# Altium schematic sheet McuESP32.SchDoc
size A4; SheetNumber: 2; SheetTotal: 6
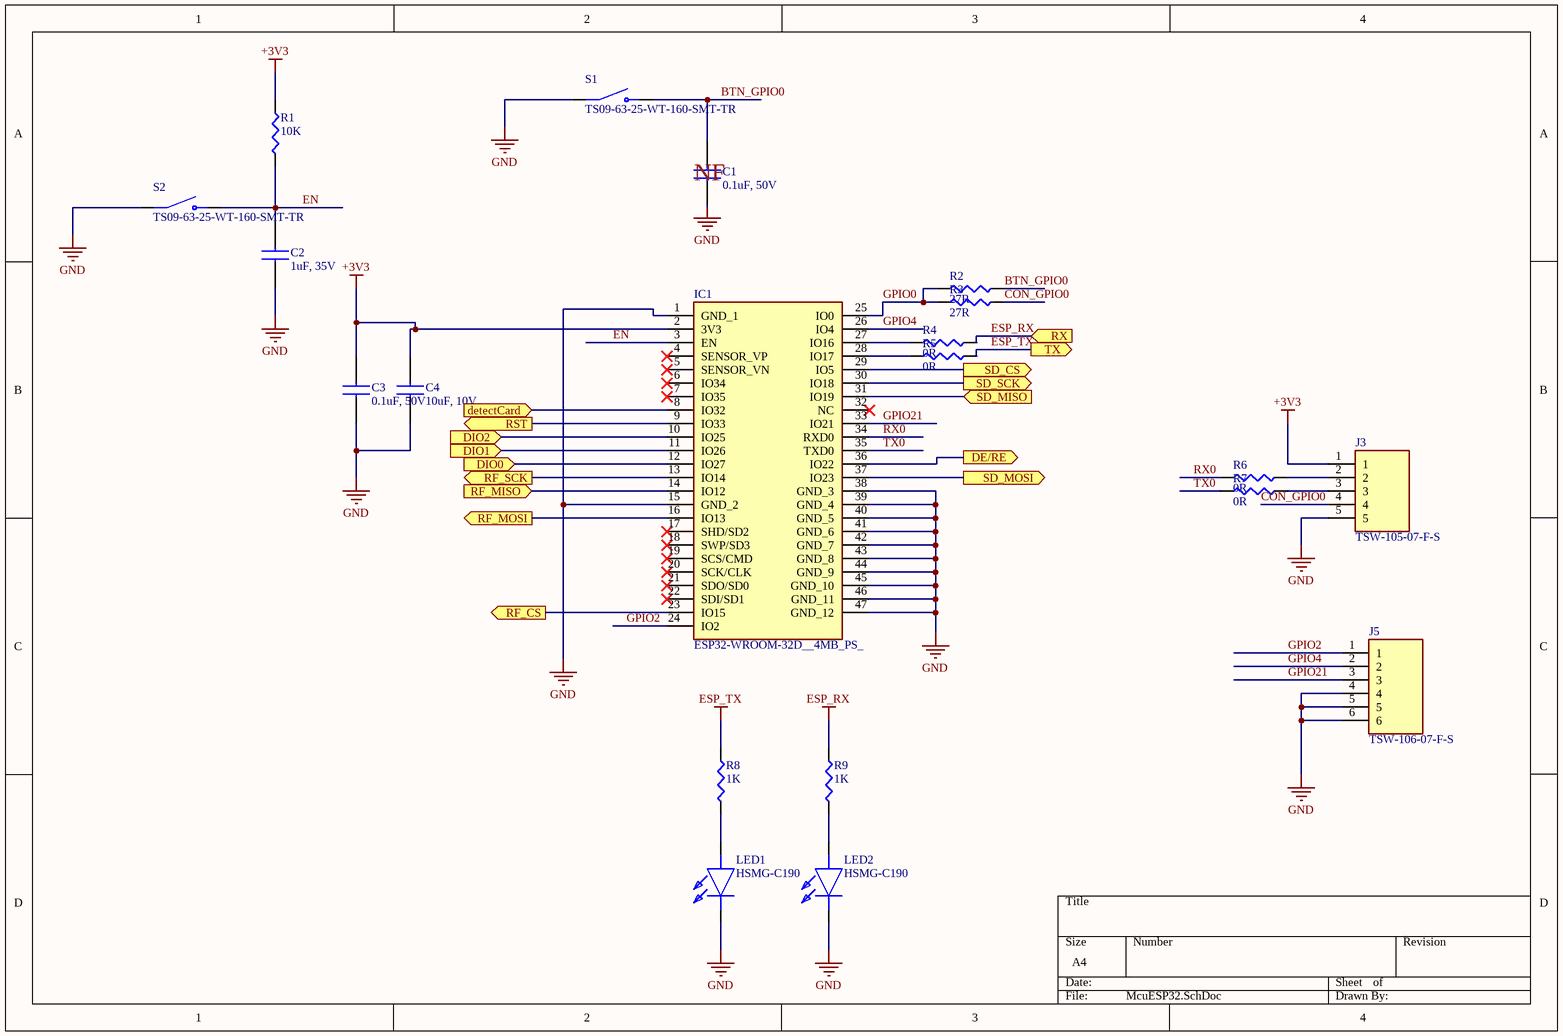
[diagram p0: McuESP32.SchDoc]

## Parts
C1  0.1uF, 50V  [CAPC1608X90N]
C2  1uF, 35V  [CAPC1608X90N]
C3  0.1uF, 50V  [CAPC1608X90N]
C4  10uF, 10V  [CAPC1608X90N]
IC1  ESP32-WROOM-32D__4MB_PS_  [ESP32WROOM32D4MBPS]
J3  TSW-105-07-F-S  [TSW-105-XX-YY-S]
J5  TSW-106-07-F-S  [TSW10607FS]
LED1  HSMG-C190  [LEDC1608X90N]
LED2  HSMG-C190  [LEDC1608X90N]
R1  10K  [RESC1607X60N]
R2  27R  [RESC1607X60N]
R3  27R  [RESC1607X60N]
R4  0R  [RESC1607X60N]
R5  0R  [RESC1607X60N]
R6  0R  [RESC1607X60N]
R7  0R  [RESC1607X60N]
R8  1K  [RESC1607X60N]
R9  1K  [RESC1607X60N]
S1  TS09-63-25-WT-160-SMT-TR  [SW_TS09-63-25-WT-160-SMT-TR]
S2  TS09-63-25-WT-160-SMT-TR  [SW_TS09-63-25-WT-160-SMT-TR]

## Ports
DE/RE (out), detectCard (in), DIO0 (in), DIO1 (in), DIO2 (in), RF_CS (out), RF_MISO (in), RF_MOSI (out), RF_SCK (out), RST (out), RX (in), SD_CS (out), SD_MISO (in), SD_MOSI (out), SD_SCK (out), TX (out)

## Nets
+3V3: C3.2 C4.1 IC1.2(3V3) J3.1 R1.2
ESP_RX: R4.2 R9.2 ; port RX
ESP_TX: R5.2 R8.2 ; port TX
GND: C1.1 C2.1 C3.1 C4.2 IC1.1(GND_1) IC1.15(GND_2) IC1.38(GND_3) IC1.39(GND_4) IC1.40(GND_5) IC1.41(GND_6) IC1.42(GND_7) IC1.43(GND_8) IC1.44(GND_9) IC1.45(GND_10) IC1.46(GND_11) IC1.47(GND_12) J3.5 J5.4 J5.5 J5.6 LED1.1(K) LED2.1(K) S1.1 S2.1
BTN_GPIO0: C1.2 R2.2 S1.2
CON_GPIO0: J3.4 R3.2
DE/RE: IC1.36(IO22) ; port DE/RE
detectCard: IC1.8(IO32) ; port detectCard
DIO0: IC1.12(IO27) ; port DIO0
DIO1: IC1.11(IO26) ; port DIO1
DIO2: IC1.10(IO25) ; port DIO2
EN: C2.2 IC1.3(EN) R1.1 S2.2
GPIO0: IC1.25(IO0) R2.1 R3.1
GPIO2: IC1.24(IO2) J5.1
GPIO4: IC1.26(IO4) J5.2
GPIO21: IC1.33(IO21) J5.3
RF_CS: IC1.23(IO15) ; port RF_CS
RF_MISO: IC1.14(IO12) ; port RF_MISO
RF_MOSI: IC1.16(IO13) ; port RF_MOSI
RF_SCK: IC1.13(IO14) ; port RF_SCK
RST: IC1.9(IO33) ; port RST
RX0: IC1.34(RXD0) R6.1
SD_CS: IC1.29(IO5) ; port SD_CS
SD_MISO: IC1.31(IO19) ; port SD_MISO
SD_MOSI: IC1.37(IO23) ; port SD_MOSI
SD_SCK: IC1.30(IO18) ; port SD_SCK
TX0: IC1.35(TXD0) R7.1
NetIC1_27: IC1.27(IO16) R4.1
NetIC1_28: IC1.28(IO17) R5.1
NetJ3_2: J3.2 R6.2
NetJ3_3: J3.3 R7.2
NetLED1_2: LED1.2(A) R8.1
NetLED2_2: LED2.2(A) R9.1

Not connected (* = marked no-connect by the designer): IC1 4(SENSOR_VP)* 5(SENSOR_VN)* 6(IO34)* 7(IO35)* 17(SHD/SD2)* 18(SWP/SD3)* 19(SCS/CMD)* 20(SCK/CLK)* 21(SDO/SD0)* 22(SDI/SD1)* 32(NC)*

## Notes on the sheet
- (near C1) NF

## Library data of the parts
C1 C3 = CL10B104KB8NNNL: CAP CER 0.1UF 50V X7R 0603; Manufacturer_Name: SAMSUNG; Datasheet Link: https://componentsearchengine.com/Datasheets/2/CL10A106MP8NNNC.pdf; Height: 0.9mm; Manufacturer_Part_Number: CL10B104KB8NNNL; Mouser Part Number: 187-CL10A106MP8NNNC; Mouser Price/Stock: https://www.mouser.co.uk/ProductDetail/Samsung-Electro-Mechanics/CL10A106MP8NNNC?qs=X6jEic%2FHinAgjcVTZfg7UA%3D%3D; Arrow Part Number: CL10A106MP8NNNC; Arrow Price/Stock: https://www.arrow.com/en/products/cl10a106mp8nnnc/samsung-electro-mechanics?utm_currency=USD&region=europe
C2 = CL10A105KL8NNNC: Ceramic Capacitor, Multilayer, Ceramic, 35V, 10% +Tol, 10% -Tol, X5R, +-15% TC, 1uF, Surface Mount, 0603 inch; Manufacturer: Samsung; Material: 4241ConductorMaterial; Supplier 1: Digikey; Manufacturer Part Number: CL10A105KL8NNNC; RoHS: Yes; Category: Ceramic Capacitors; Stock 1: 11037; Pricing 1: 1=0,13, 10=0,073, 100=0,044, 1000=0,03277 (USD); Voltage Rating (DC): 35V; Height: 900um; Lead Free: 5697LeadFree; ComponentLink1URL: https://datasheet.ciiva.com/25773/cl10a105kl8nnnc-25773809.pdf?src-supplier=Digikey; ComponentLink1Description: https://datasheet.ciiva.com/25773/cl10a105kl8nnnc-25773809.pdf?src-supplier=Digikey; ComponentLink2URL: https://datasheet.ciiva.com/16202/clseries-16202344.pdf?src-supplier=Future+Electronics; ComponentLink2Description: https://datasheet.ciiva.com/16202/clseries-16202344.pdf?src-supplier=Future+Electronics
C4 = CL10A106MP8NNNC: CAP CER 10UF 10V X5R 0603; Manufacturer_Name: SAMSUNG; Datasheet Link: https://componentsearchengine.com/Datasheets/2/CL10A106MP8NNNC.pdf; Height: 0.9mm; Manufacturer_Part_Number: CL10A106MP8NNNC; Mouser Part Number: 187-CL10A106MP8NNNC; Mouser Price/Stock: https://www.mouser.co.uk/ProductDetail/Samsung-Electro-Mechanics/CL10A106MP8NNNC?qs=X6jEic%2FHinAgjcVTZfg7UA%3D%3D; Arrow Part Number: CL10A106MP8NNNC; Arrow Price/Stock: https://www.arrow.com/en/products/cl10a106mp8nnnc/samsung-electro-mechanics?utm_currency=USD&region=europe
IC1 = ESP32-WROOM-32D__4MB_PS_: Integrated Circuit; Manufacturer_Name: Espressif Systems; Manufacturer_Part_Number: ESP32-WROOM-32D (4MB PS); Datasheet Link: https://www.mouser.com/datasheet/2/891/esp32-wroom-32d_esp32-wroom-32u_datasheet_en-1365844.pdf; Height: 3.2mm; Mouser Part Number: 356-ESPWROOM3200PS3; Mouser Price/Stock: https://www.mouser.co.uk/ProductDetail/Espressif-Systems/ESP32-WROOM-32D-4MB-PS?qs=GBLSl2Akirs5uooPY1MBgw%3D%3D
J3 = TSW-105-07-F-S: Connector; Manufacturer_Name: SAMTEC; Datasheet Link: http://suddendocs.samtec.com/prints/tsw-xxx-xx-xxx-x-xx-xxx-mkt.pdf; Manufacturer_Part_Number: TSW-105-07-F-S; Mouser Part Number: 200-TSW10507FS; Mouser Price/Stock: https://www.mouser.co.uk/ProductDetail/Samtec/TSW-105-07-F-S?qs=rU5fayqh%252BE0rjSr2FD4jkw%3D%3D; Arrow Part Number: TSW-105-07-F-S; Arrow Price/Stock: https://www.arrow.com/en/products/tsw-105-07-f-s/samtec?region=europe
J5 = TSW-106-07-F-S: Connector; Manufacturer_Name: SAMTEC; Datasheet Link: http://suddendocs.samtec.com/prints/tsw-xxx-xx-xxx-x-xx-xxx-mkt.pdf; Height: 8.38mm; Manufacturer_Part_Number: TSW-106-07-F-S; Mouser Part Number: 200-TSW10607FS; Mouser Price/Stock: https://www.mouser.co.uk/ProductDetail/Samtec/TSW-106-07-F-S?qs=rU5fayqh%252BE1Xwj0%2Fe2Xn%2Fw%3D%3D; Arrow Part Number: TSW-106-07-F-S; Arrow Price/Stock: https://www.arrow.com/en/products/tsw-106-07-f-s/samtec?region=nac
LED1 LED2 = HSMG-C190: Green LED 0603 (1608 Metric); Manufacturer_Name: Avago Technologies; Datasheet Link: https://docs.broadcom.com/docs/AV02-0551EN; Height: 0.9mm; Manufacturer_Part_Number: HSMG-C190; Mouser Part Number: 630-HSMG-C190; Mouser Price/Stock: https://www.mouser.co.uk/ProductDetail/Broadcom-Avago/HSMG-C190?qs=YDL0qNrpDT605sxOaps8VQ%3D%3D
R1 = RC0603JR-0710KL: RES 10K OHM 5% 1/10W 0603; Manufacturer: Yageo; Resistance: 10kR; Temperature Coefficient: 100ppm/°C; Voltage Rating (AC): 50V; Max Power Dissipation: 100mW; Supplier 1: Digikey; Manufacturer Part Number: RC0603JR-0710KL; RoHS: Yes; Category: Chip SMD Resistors; Stock 1: 50431; Pricing 1: 1=0,1, 10=0,008, 50=0,0072, 100=0,0061, 500=0,0051 (USD); Case/Package: 0603; Min Operating Temperature: -55°C; Max Operating Temperature: 155°C; Tolerance: 5%; Number of Terminations: 2; Series: RC; Reach SVHC Compliant: 4187SVHC; Lead Free: 5697LeadFree; RoHS Compliant: Yes; ComponentLink1URL: https://datasheet.ciiva.com/2452/pyu-rc-group-51-rohs-l-10-2452848.pdf?src-supplier=Digikey; ComponentLink1Description: https://datasheet.ciiva.com/2452/pyu-rc-group-51-rohs-l-10-2452848.pdf?src-supplier=Digikey
R2 R3 = RC0603JR-0727RL: RES 27 OHM 5% 1/10W 0603; Manufacturer: Yageo; Voltage Rating (AC): 50V; Supplier 1: Digikey; Manufacturer Part Number: RC0603JR-0727RL; RoHS: Yes; Category: Chip SMD Resistors; Stock 1: 235857; Pricing 1: 1=0,1, 10=0,008, 50=0,0072, 100=0,0061, 500=0,00562, 1000=0,0051 (USD); Lead Free: 5697LeadFree; ComponentLink1URL: https://datasheet.ciiva.com/7746/443971-7746479.pdf?src-supplier=Element14; ComponentLink1Description: https://datasheet.ciiva.com/7746/443971-7746479.pdf?src-supplier=Element14
R4-R7 = RC0603JR-070RL: RES 0 OHM JUMPER 1/10W 0603; Manufacturer: Yageo; Resistance: 0mR; Tolerance: 1%; Voltage Rating: 50V; Power Rating: 100mW; Temperature Coefficient: 200ppm/°C; Resistance Tolerance: 5%; Supplier 1: Digikey; Manufacturer Part Number: RC0603JR-070RL; RoHS: Yes; Category: Chip SMD Resistors; Stock 1: 2438419; Pricing 1: 1=0,1, 10=0,01, 25=0,008, 50=0,0068, 100=0,0059, 250=0,00496, 500=0,00436, 1000=0,00384, 5000=0,00292, 10000=0,00262, 15000=0,00246, 25000=0,00229, 35000=0,00218, 50000=0,00208, 125000=0,00185, 250000=0,00171, 500000=0,00159 (USD); Case/Package: 0603; Number of Pins: 2; Case Code (Imperial): 0603; Contact Plating: Tin,Matte; Case Code (Metric): 1608; Size Code: 0603; Min Operating Temperature: -55°C; Max Operating Temperature: 155°C; Packaging: Tape and Reel; Voltage Rating (DC): 50V; Termination: SMD/SMT; Package Quantity: 5000; Resistor Type: Thick Film; Features: Moisture Resistant; Series: RC; Max Power Dissipation: 100mW; Number of Terminations: 2; Construction: Rectangular; Technology: THICK FILM; Length: 1.6mm; Width: 0.8mm; Height: 0.45mm; Depth: 0.8mm; Military Standard: Not; Reach SVHC Compliant: Unknown; Lead Free: 5697LeadFree; RoHS Compliant: Yes; ComponentLink1URL: https://datasheet.ciiva.com/11808/pyu-r-int-6-11808700.pdf?src-supplier=Rs; ComponentLink1Description: https://datasheet.ciiva.com/11808/pyu-r-int-6-11808700.pdf?src-supplier=Rs; ComponentLink2URL: https://datasheet.ciiva.com/22747/443971-22747530.pdf?src-supplier=Element14; ComponentLink2Description: https://datasheet.ciiva.com/22747/443971-22747530.pdf?src-supplier=Element14; ComponentLink3URL: https://datasheet.ciiva.com/12555/rc0603-272842-12555254.pdf?src-supplier=Mouser; ComponentLink3Description: https://datasheet.ciiva.com/12555/rc0603-272842-12555254.pdf?src-supplier=Mouser; ComponentLink4URL: https://datasheet.ciiva.com/7746/1738695-7746421.pdf?src-supplier=Element14; ComponentLink4Description: https://datasheet.ciiva.com/7746/1738695-7746421.pdf?src-supplier=Element14; ComponentLink5URL: https://datasheet.ciiva.com/7746/1738695-7746422.pdf?src-supplier=Element14; ComponentLink5Description: https://datasheet.ciiva.com/7746/1738695-7746422.pdf?src-supplier=Element14
R8 R9 = RT0603BRD071KL: Fixed Resistor, Thin Film, 0.1W, 1000ohm, 75V, 0.1% +/-Tol, 25ppm/Cel, Surface Mount, 0603; Manufacturer: Yageo; Resistance: 1kR; Power Rating: 100mW; Temperature Coefficient: 25ppm/°C; Voltage Rating (DC): 50V; Supplier 1: Digikey; Manufacturer Part Number: RT0603BRD071KL; RoHS: Yes; Category: Chip SMD Resistors; Stock 1: 60333; Pricing 1: 1=0,15, 10=0,108, 50=0,0868, 100=0,0775, 500=0,06018, 1000=0,05202 (USD); Mount: Surface Mount; Case/Package: 0603; Case Code (Metric): 1608; Case Code (Imperial): 0603; Contact Plating: Tin,Lead; Size Code: 0603; Min Operating Temperature: -55°C; Max Operating Temperature: 155°C; Package Quantity: 5000; Packaging: Tape and Reel; Voltage Rating: 75V; Number of Terminations: 2; Termination: SMD/SMT; Max Power Dissipation: 100mW; Features: Moisture Resistant; Series: RT; Technology: THIN FILM; Length: 0.063inch; Width: 0.031inch; Height: 0.022inch; Depth: 0.8mm; RoHS Compliant: Yes; Lead Free: 5697LeadFree; ComponentLink1URL: https://datasheet.ciiva.com/11819/0900766b8079c86e-11819652.pdf?src-supplier=Rs; ComponentLink1Description: https://datasheet.ciiva.com/11819/0900766b8079c86e-11819652.pdf?src-supplier=Rs; ComponentLink2URL: https://datasheet.ciiva.com/5624/pyu-rt-1-to-0-05-rohs-l-4-5624759.pdf?src-supplier=Mouser; ComponentLink2Description: https://datasheet.ciiva.com/5624/pyu-rt-1-to-0-05-rohs-l-4-5624759.pdf?src-supplier=Mouser
S1 S2 = TS09-63-25-WT-160-SMT-TR: SWITCH TACTILE SPST-NO 0.05A 12V; MF: Same Sky; SnapEDA_Link: https://www.snapeda.com/parts/TS09-63-25-WT-160-SMT-TR/Same+Sky/view-part/?ref=snap; Package: None; Value: *; MP: TS09-63-25-WT-160-SMT-TR; Check_prices: https://www.snapeda.com/parts/TS09-63-25-WT-160-SMT-TR/Same+Sky/view-part/?ref=eda